# EAGLE board megadonkey_rev0 (EAGLE 4.16), part 1 of 2
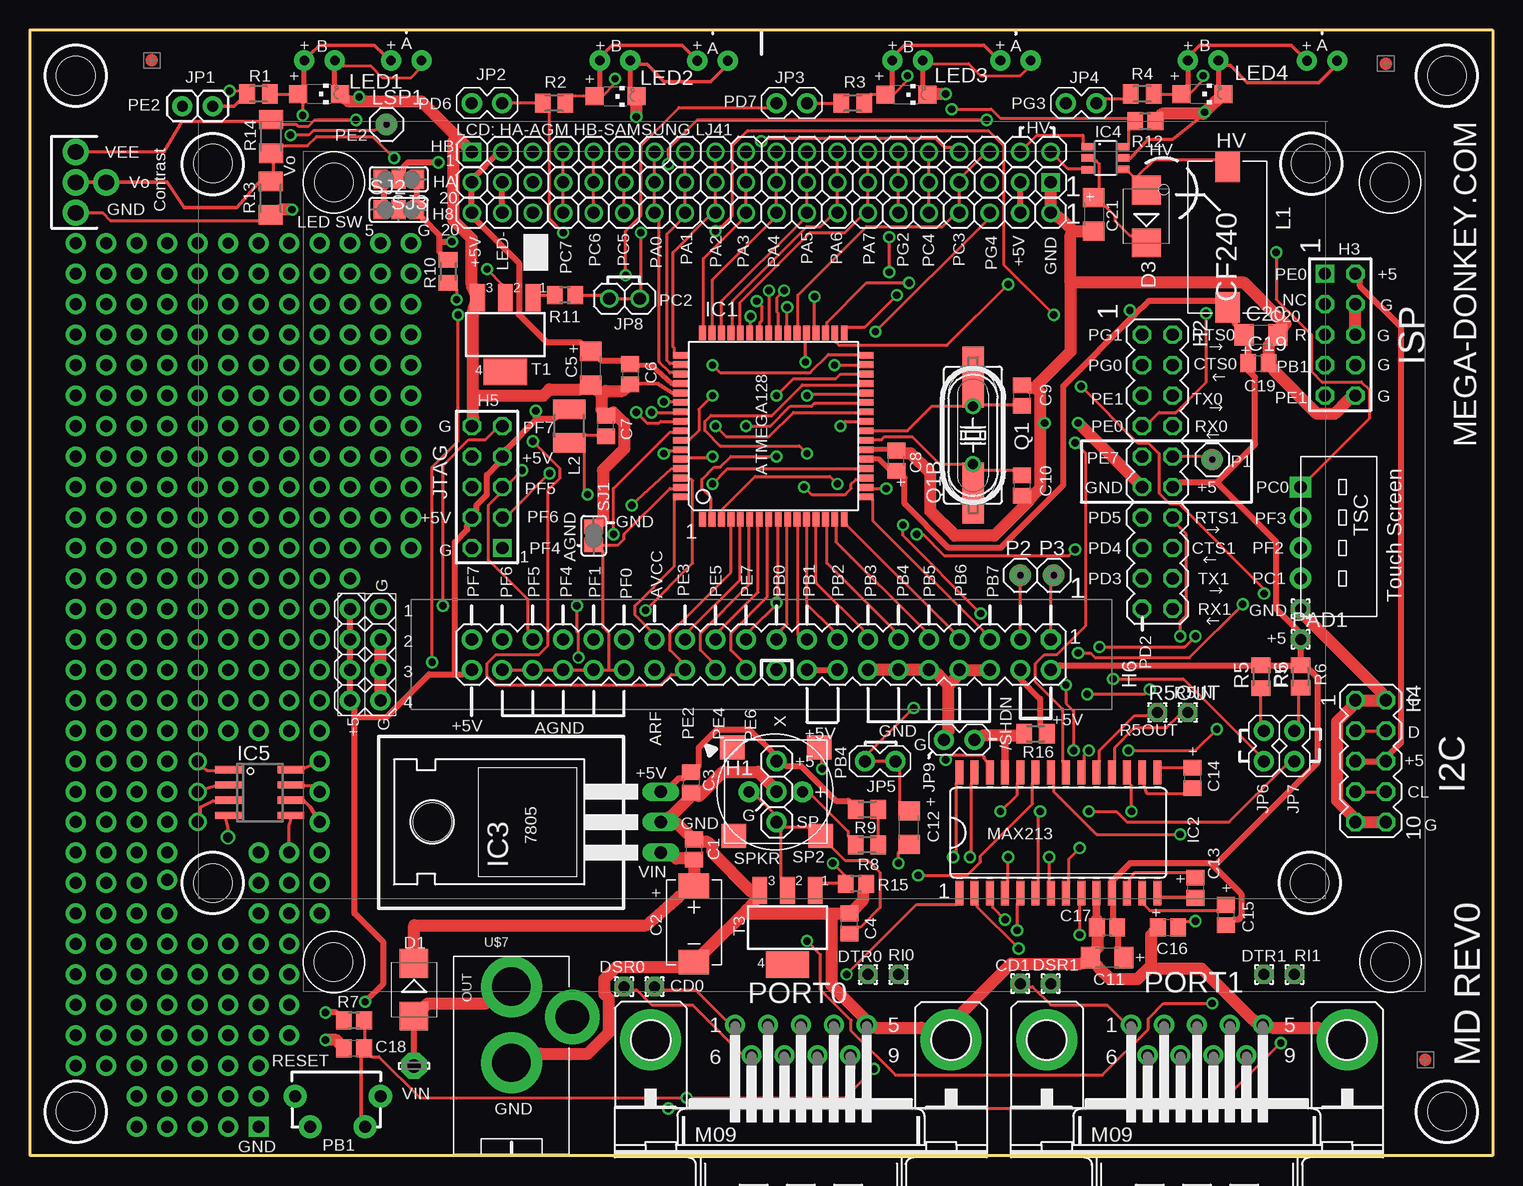
[diagram p2: board, top side]
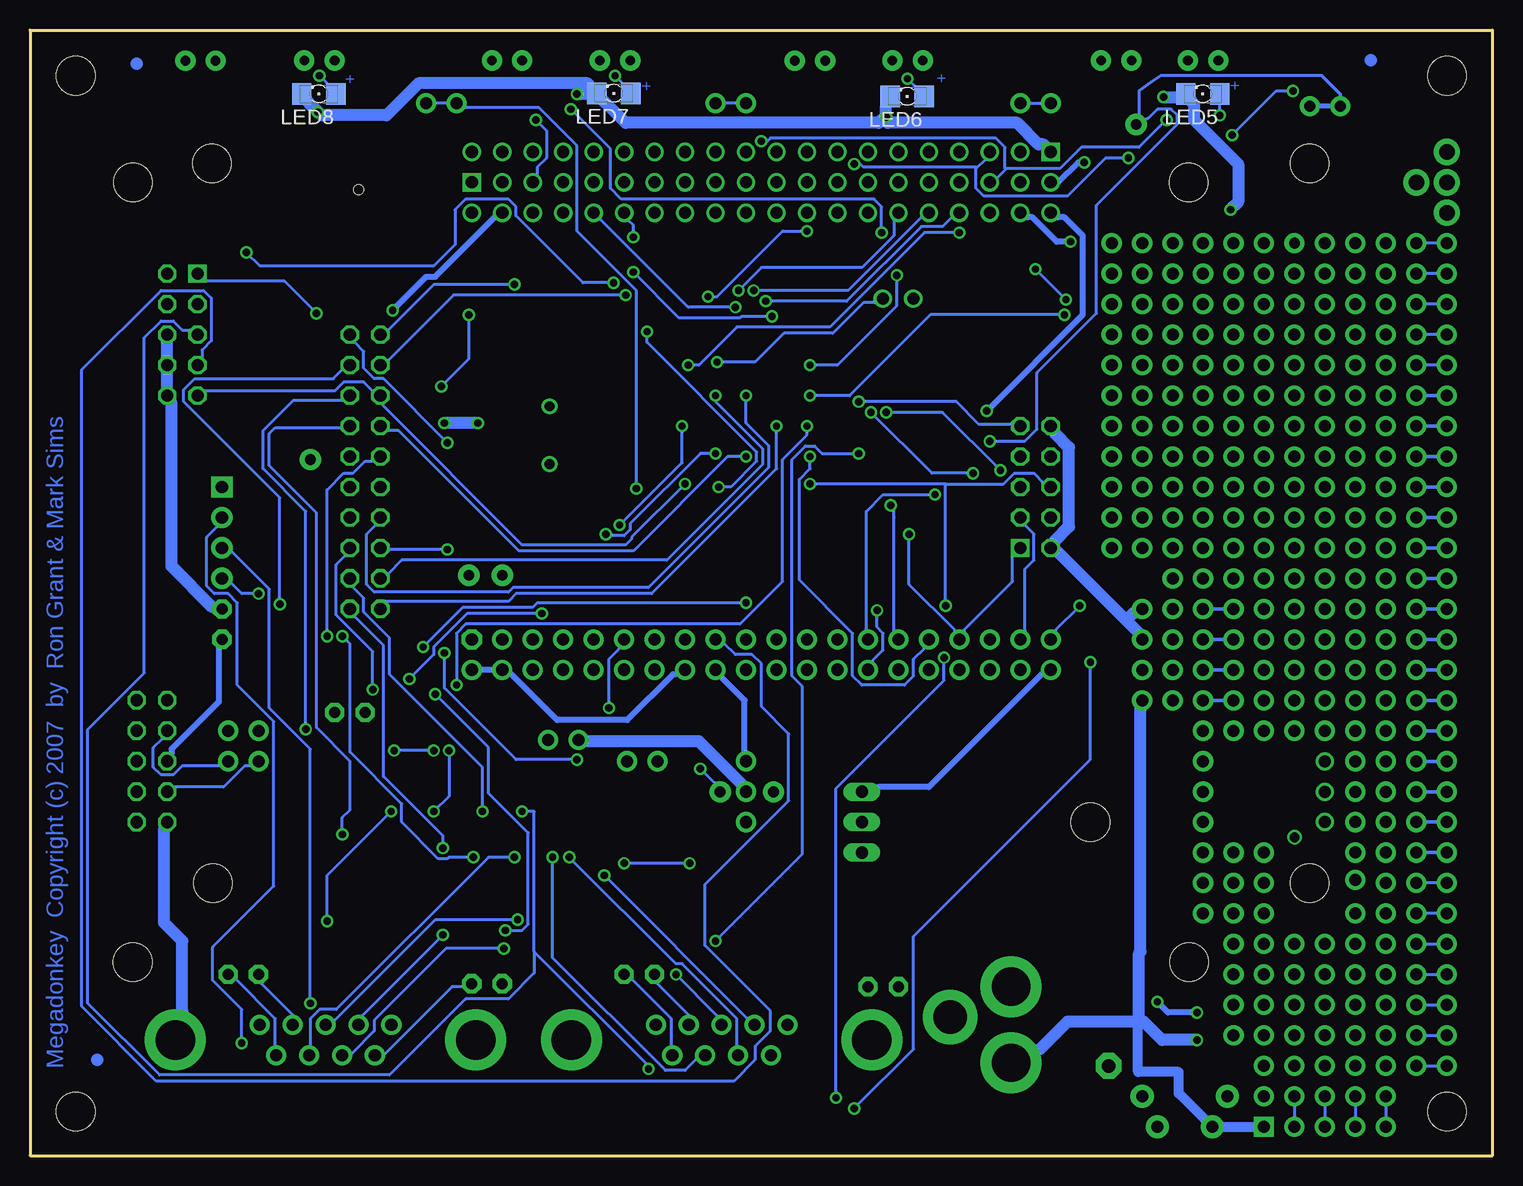
[diagram p3: board, bottom side, seen from below]

Size 121.92 x 93.85 mm. Coordinates in mm from the lower left corner, seen from the top.
Outline: 121.92,0 0,0 0,93.85 121.92,93.85 121.92,0
Copper layers (1*16): Top 0.035mm / dielectric 1.5mm / Bottom 0.035mm
Design rules "default": minimum track width 10mil, minimum drill 24mil, track to track 10mil, track to pad 10mil, pad to pad 10mil, via to via 10mil, smd to smd 8mil, copper to edge 10mil, drill to drill 15mil, minimum pad ring 10mil, minimum via ring 8mil, stop-mask expansion 2.5mil, vias tented up to drill 0mil, thermal gap 10mil
Net classes: 1 VCC: width 0.508 mm; 2 GND: width 1.016 mm
Holes 3.2 mm at 3.81,90.04 3.81,3.68 118.11,3.68 118.11,90.04
Holes 0.8 mm at 94.51,80.54
tRestrict: area -1.8,-21.5 to 124.2,1.7; area 91.8,76.8 to 93.6,79.6; area 87.4,77.6 to 88.6,81.7; area 95,83.7 to 96.3,85; area 89.7,80.9 to 90.4,82.9; area 82.3,85.5 to 89.4,86.2; area 81.9,82.2 to 83.9,82.8; area 81.3,82.7 to 81.8,85; area 86.6,82.4 to 87.6,85; area 83.6,82.7 to 84.1,84.5; area 84.1,84.5 to 86.9,85; area 101.3,77.1 to 102.9,84.2; 33 more areas
bRestrict: area -2.8,-22 to 123.7,1.7; area 82.3,83.4 to 89.7,85.7; area 86.6,76.1 to 102.9,85; area 81.3,82.7 to 81.8,85; area 81.9,82.3 to 83.9,82.8; area 85.6,81.9 to 86.6,83.4; area 109.7,77.7 to 111,85.3; area 75.3,54 to 83.7,65.9; area -0.5,21.2 to 25.1,77.3; area 71.5,58.5 to 75.8,63.6; area 77.1,63.9 to 80.1,67.9; area -1,-1.1 to 17.3,22.5; 15 more areas; 2 lines
vRestrict: area 55.1,66.7 to 69.1,67.9; area 55.1,53.7 to 56.4,67.7; area 54.6,54.2 to 69.1,55.2; area 68.1,53.7 to 69.1,67.7; area 76.6,26.2 to 95.4,27.7; area 76.6,29.2 to 95.6,31; area 57.7,53.7 to 58.9,67.7; area 60.2,53.7 to 61.5,67.7; area 62.7,53.7 to 64,67.7; area 65.3,53.7 to 66.5,67.7; area 55.1,64.1 to 69.1,65.4; area 57.7,53.7 to 58.9,67.7; 25 more areas

## Footprints (pad centres in the part's own frame; a part is rotated, then mirrored left to right if it is on the bottom)
J100-2 = drill 1 pad 1.676 round: 1 -1.27,0; 2 1.27,0
C0805 = smd 1.3 x 1.5: 1 -0.85,0; 2 0.85,0
SMD2917 = smd 2.032 x 2.54: M 3.302,0; P -3.048,0
C1206 = smd 1.6 x 1.8: 1 -1.4,0; 2 1.4,0
1,6/0,9 = drill 0.914 pad 1.6 octagon: 1 0,0
SMB = smd 2.4 x 2.4: A 2.2,0; C -2.2,0
1X03 = drill 1.016 pad 1.676 round: 1 -2.54,0; 2 0,0; 3 2.54,0
MA10-2 = drill 1.016 octagon: 1 -11.43,-1.27; 2 -11.43,1.27; 3 -8.89,-1.27; 4 -8.89,1.27; 5 -6.35,-1.27; 6 -6.35,1.27; 7 -3.81,-1.27; 8 -3.81,1.27; 9 -1.27,-1.27; 10 -1.27,1.27; 11 1.27,-1.27; 12 1.27,1.27; 13 3.81,-1.27; 14 3.81,1.27; 15 6.35,-1.27; 16 6.35,1.27; 17 8.89,-1.27; 18 8.89,1.27; 19 11.43,-1.27; 20 11.43,1.27
AVR-ISP-10 = drill 1.016 square: 1 -5.08,-1.27 | drill 1.016 octagon: 2 -5.08,1.27; 3 -2.54,-1.27; 4 -2.54,1.27; 5 0,-1.27; 6 0,1.27; 7 2.54,-1.27; 8 2.54,1.27; 9 5.08,-1.27; 10 5.08,1.27
MA05-2 = drill 1.016 octagon: 1 -5.08,-1.27; 2 -5.08,1.27; 3 -2.54,-1.27; 4 -2.54,1.27; 5 0,-1.27; 6 0,1.27; 7 2.54,-1.27; 8 2.54,1.27; 9 5.08,-1.27; 10 5.08,1.27
AVR-JTAG-10 = drill 1.016 square: 1 -5.08,-1.27 | drill 1.016 octagon: 2 -5.08,1.27; 3 -2.54,-1.27; 4 -2.54,1.27; 5 0,-1.27; 6 0,1.27; 7 2.54,-1.27; 8 2.54,1.27; 9 5.08,-1.27; 10 5.08,1.27
MA20X2 = drill 1.016 pad 1.676 octagon: 1 -24.13,-1.27 | drill 1.016 pad 1.676 round: 2 -24.13,1.27; 3 -21.59,-1.27; 4 -21.59,1.27; 5 -19.05,-1.27; 6 -19.05,1.27; 7 -16.51,-1.27; 8 -16.51,1.27; 9 -13.97,-1.27; 10 -13.97,1.27; 11 -11.43,-1.27; 12 -11.43,1.27; 13 -8.89,-1.27; 14 -8.89,1.27; 15 -6.35,-1.27; 16 -6.35,1.27; 17 -3.81,-1.27; 18 -3.81,1.27; 19 -1.27,-1.27; 20 -1.27,1.27; 21 1.27,-1.27; 22 1.27,1.27; 23 3.81,-1.27; 24 3.81,1.27; 25 6.35,-1.27; 26 6.35,1.27; 27 8.89,-1.27; 28 8.89,1.27; 29 11.43,-1.27; 30 11.43,1.27; 31 13.97,-1.27; 32 13.97,1.27; 33 16.51,-1.27; 34 16.51,1.27; 35 19.05,-1.27; 36 19.05,1.27; 37 21.59,-1.27; 38 21.59,1.27; 39 24.13,-1.27; 40 24.13,1.27
1X20 = drill 1.016 round: 1 -24.13,0; 2 -21.59,0; 3 -19.05,0; 4 -16.51,0; 5 -13.97,0; 6 -11.43,0; 7 -8.89,0; 8 -6.35,0; 9 -3.81,0; 10 -1.27,0; 11 1.27,0; 12 3.81,0; 13 6.35,0; 14 8.89,0; 15 11.43,0; 16 13.97,0; 17 16.51,0; 18 19.05,0; 19 21.59,0; 20 24.13,0
1X20_AGM1264F = drill 1.016 square: 1 22.86,0 | drill 1.016 round: 2 20.32,0; 3 17.78,0; 4 15.24,0; 5 12.7,0; 6 10.16,0; 7 7.62,0; 8 5.08,0; 9 2.54,0; 10 0,0; 11 -2.54,0; 12 -5.08,0; 13 -7.62,0; 14 -10.16,0; 15 -12.7,0; 16 -15.24,0; 17 -17.78,0; 18 -20.32,0; 19 -22.86,0; 20 -25.4,0 | hole 3.2: -36.906,0; -36.932,-65.024; 51.13,-65.024; 51.105,0
1X20P = drill 1.016 square: 1 -25.4,0 | drill 1.016 round: 2 -22.86,0; 3 -20.32,0; 4 -17.78,0; 5 -15.24,0; 6 -12.7,0; 7 -10.16,0; 8 -7.62,0; 9 -5.08,0; 10 -2.54,0; 11 0,0; 12 2.54,0; 13 5.08,0; 14 7.62,0; 15 10.16,0; 16 12.7,0; 17 15.24,0; 18 17.78,0; 19 20.32,0; 20 22.86,0 | hole 3.2: -46.99,-0.953; 44.514,-0.953; 44.45,-60.96; -46.99,-60.96
TQFP64 = smd 1.194 x 0.559: 1 -7.76,5.905; 2 -7.76,5.118; 3 -7.76,4.331; 4 -7.76,3.543; 5 -7.76,2.756; 6 -7.76,1.968; 7 -7.76,1.181; 8 -7.76,0.394; 9 -7.76,-0.394; 10 -7.76,-1.181; 11 -7.76,-1.968; 12 -7.76,-2.756; 13 -7.76,-3.543; 14 -7.76,-4.331; 15 -7.76,-5.118; 16 -7.76,-5.905; 33 7.76,-5.905; 34 7.76,-5.118; 35 7.76,-4.331; 36 7.76,-3.543; 37 7.76,-2.756; 38 7.76,-1.968; 39 7.76,-1.181; 40 7.76,-0.394; 41 7.76,0.394; 42 7.76,1.181; 43 7.76,1.968; 44 7.76,2.756; 45 7.76,3.543; 46 7.76,4.331; 47 7.76,5.118; 48 7.76,5.905 | smd 0.559 x 1.194: 17 -5.905,-7.76; 18 -5.118,-7.76; 19 -4.331,-7.76; 20 -3.543,-7.76; 21 -2.756,-7.76; 22 -1.968,-7.76; 23 -1.181,-7.76; 24 -0.394,-7.76; 25 0.394,-7.76; 26 1.181,-7.76; 27 1.968,-7.76; 28 2.756,-7.76; 29 3.543,-7.76; 30 4.331,-7.76; 31 5.118,-7.76; 32 5.905,-7.76; 49 5.905,7.76; 50 5.118,7.76; 51 4.331,7.76; 52 3.543,7.76; 53 2.756,7.76; 54 1.968,7.76; 55 1.181,7.76; 56 0.394,7.76; 57 -0.394,7.76; 58 -1.181,7.76; 59 -1.968,7.76; 60 -2.756,7.76; 61 -3.543,7.76; 62 -4.331,7.76; 63 -5.118,7.76; 64 -5.905,7.76
SO28L = smd 0.66 x 2.032: 1 -8.255,-5.029; 2 -6.985,-5.029; 3 -5.715,-5.029; 4 -4.445,-5.029; 5 -3.175,-5.029; 6 -1.905,-5.029; 7 -0.635,-5.029; 8 0.635,-5.029; 9 1.905,-5.029; 10 3.175,-5.029; 11 4.445,-5.029; 12 5.715,-5.029; 13 6.985,-5.029; 14 8.255,-5.029; 15 8.255,5.029; 16 6.985,5.029; 17 5.715,5.029; 18 4.445,5.029; 19 3.175,5.029; 20 1.905,5.029; 21 0.635,5.029; 22 -0.635,5.029; 23 -1.905,5.029; 24 -3.175,5.029; 25 -4.445,5.029; 26 -5.715,5.029; 27 -6.985,5.029; 28 -8.255,5.029
7805H = drill 1.016 long: 1 -2.54,-6.35; 2 0,-6.35; 3 2.54,-6.35 | hole 3.2: 0,12.7
TOKO6_3MM = smd 0.6 x 1: 1 -0.95,-1.5; 2 0,-1.5; 3 1,-1.5; 4 0.95,1.5; 5 0,1.5; 6 -0.95,1.5
SO-8 = smd 0.6 x 2.2: 1 -1.905,-2.6; 2 -0.635,-2.6; 3 0.635,-2.6; 4 1.905,-2.6; 5 1.905,2.6; 6 0.635,2.6; 7 -0.635,2.6; 8 -1.905,2.6
1X02 = drill 1.016 round: 1 -1.27,0; 2 1.27,0
SMD550X240 = smd 2.54 x 2.032: 1 -5.842,0; 2 5.842,0
R1210 = smd 1.6 x 2.7: 1 -1.4,0; 2 1.4,0
CHIPLED_1206 = smd 1.5 x 1.5: A 0,-1.75; C 0,1.75
1206 = smd 1.6 x 1.803: A -1.422,0; C 1.422,0
MCS08 = drill 0.9 pad 1.778 round: MP 0,0
M09H0500 = drill 1.016 pad 1.676 round: 1 -5.486,8.255; 2 -2.743,8.255; 3 0,8.255; 4 2.743,8.255; 5 5.486,8.255; 6 -4.115,5.715; 7 -1.372,5.715; 8 1.372,5.715; 9 4.115,5.715 | drill 3.302 pad 5.08 round: G1 -12.522,6.985; G2 12.522,6.985
HC49U70 = drill 0.813 round: 1 -2.413,0; 2 2.413,0
SM49 = smd 5.08 x 1.778: 1 -4.826,0; 2 4.826,0
M0805 = smd 1.3 x 1.6: 1 -0.95,0; 2 0.95,0
R0805 = smd 1.3 x 1.5: 1 -0.85,0; 2 0.85,0
M1206 = smd 1.6 x 2: 1 -1.4,0; 2 1.4,0
SJ = smd 1.168 x 1.6: 1 -0.762,0; 2 0.762,0
SJ_2 = smd 1.168 x 1.6: 1 -1.524,0; 2 0,0; 3 1.524,0
BG_SPKR = drill 0.9 pad 1.778 round: 1 -2.286,0; 2 2.159,0
CHB-04H = smd 2.032 x 2.032: 1 -3.683,3.683; 2 -3.556,-3.683; 3 3.556,3.683; 4 3.683,-3.683
SOT223 = smd 1.219 x 2.235: 1 -2.311,-3.099; 2 0,-3.099; 3 2.311,-3.099 | smd 3.6 x 2.2: 4 0,3.099
FFC4-VERT = drill 1.016 pad 1.778 square: 1 -3.81,0 | drill 1.016 pad 1.778 round: 2 -1.27,0; 3 1.27,0; 4 3.81,0
POWER_21 = drill 2.8 pad 4.572 round: BAT 5.08,3.81 | drill 3.2 pad 5.08 round: COM 0,0; OUT 0,6.35
LSP11 = drill 1.118 pad 2.159 octagon: MP 0,0

## Placement (x,y rotation side)
1  [J100-2]  27.94,45.59 0 top
2  [J100-2]  27.94,43.05 0 top
3  [J100-2]  27.94,40.51 0 top
4  [J100-2]  27.94,37.97 0 top
C1  0.1 uF  [C0805]  55.37,25.53 90 top
C2  15 uF TANT  [SMD2917]  55.35,19.46 270 top
C3  0.1 uF  [C0805]  55.12,31.12 270 top
C4  0.47 uF  [C0805]  68.33,19.35 90 top
C5  10 uF  [C1206]  46.74,65.66 270 top
C6  .1 uF  [C0805]  50.04,65.15 270 top
C7  .1 uF  [C0805]  48.01,60.83 90 top
C8  .1 uF  [C0805]  72.21,57.94 90 top
C9  18 pF  [C0805]  82.68,63.37 90 top
C10  18 pF  [C0805]  82.68,55.88 270 top
C11  10 uF  [C1206]  89.79,16.51 180 top
C12  10 uF  [C1206]  73.28,27.36 90 top
C13  0.47uF  [C0805]  97.16,22.35 270 top
C14  0.47uF  [C0805]  96.9,31.5 270 top
C15  0.47uF  [C0805]  99.7,20.07 270 top
C16  0.47uF  [C0805]  94.87,19.05 0 top
C17  .1 uF  [C0805]  89.79,19.05 180 top
C18  [C0805]  27,8.94 180 top
C19  0.1 uF  [C0805]  102.39,66.07 0 top
C20  10 uF  [C1206]  102.62,68.45 0 top
C21  .1 uF 100V  [C1206]  88.67,78.49 270 top
CD0  [1,6/0,9]  52.07,14.1 0 top
CD1  [1,6/0,9]  82.55,14.35 0 top
D1  MBRS140  [SMB]  32,13.84 270 top
D3  MURS130  [SMB]  93.07,78.31 90 top
DSR0  [1,6/0,9]  49.53,14.1 0 top
DSR1  [1,6/0,9]  85.09,14.35 0 top
DTR0  [1,6/0,9]  69.85,15.11 0 top
DTR1  [1,6/0,9]  102.87,15.11 0 top
GND  G  [1,6/0,9]  105.92,45.59 0 top
H1  HEADER1X3  [1X03]  62.23,30.35 90 top
H2  [MA10-2]  93.98,57.02 270 top
H3  AVR-ISP-10  [AVR-ISP-10]  109.22,68.45 270 top
H4  [MA05-2]  111.76,32.89 270 top
H5  AVR-JTAG-10  [AVR-JTAG-10]  38.1,55.75 90 top
H6  MA20-2_SHROUD  [MA20X2]  60.96,41.78 180 top
H8  [1X20]  60.96,78.61 180 top
HA  LCD_AGM1264F  [1X20_AGM1264F]  62.23,81.15 0 top
HB  EL_LCD  [1X20P]  62.23,83.69 0 top
IC1  ATMEGA128-2  [TQFP64]  61.98,60.83 90 top
IC2  MAX213ECWI  [SO28L]  85.73,26.92 0 top
IC3  7805  [7805H]  46.23,27.81 90 top
IC4  TK6593  [TOKO6_3MM]  89.66,83.18 270 top
IC5  [SO-8]  19.15,30.28 270 top
JP2  [J100-2]  38.1,87.76 0 top
JP3  [J100-2]  63.5,87.76 0 top
JP4  [J100-2]  87.63,87.76 0 top
JP5  [J100-2]  70.87,32.89 0 top
JP6  [J100-2]  102.87,34.16 270 top
JP7  [J100-2]  105.41,34.16 270 top
JP8  [1X02]  49.56,71.45 0 top
JP9  [J100-2]  77.47,34.67 180 top
L1  470 uH  [SMD550X240]  99.82,76.58 90 top
L2  10 uH  [R1210]  44.96,60.83 90 top
LED1  [CHIPLED_1206]  24.1,88.52 270 top
LED2  [CHIPLED_1206]  48.79,88.32 270 top
LED3  [CHIPLED_1206]  73.05,88.47 270 top
LED4  [CHIPLED_1206]  97.74,88.52 270 top
LED5  [1206]  24.16,88.52 180 bottom
LED6  [1206]  48.79,88.32 180 bottom
LED7  [1206]  73.25,88.57 180 bottom
LED8  [1206]  97.84,88.52 180 bottom
LSP1  MCS08  [MCS08]  29.72,85.98 0 top
P1  MCS08  [MCS08]  98.55,58.04 0 top
P2  MCS08  [MCS08]  82.55,48.39 0 top
P3  MCS08  [MCS08]  85.34,48.39 0 top
PAD1  [1,6/0,9]  105.92,43.05 0 top
PORT0  SUBD9M500  [M09H0500]  64.26,2.67 0 top
PORT1  SUBD9M500  [M09H0500]  97.28,2.67 0 top
Q1  16 MHz  [HC49U70]  78.61,60.07 90 top
Q1B  NC  [SM49]  78.61,60.07 90 top
R1  10.2K  [M0805]  19.05,88.52 0 top
R2  10.2K  [M0805]  43.69,87.76 0 top
R3  10.2K  [M0805]  68.58,87.76 0 top
R4  10.2K  [M0805]  92.71,88.52 0 top
R5  1.58K  [M0805]  102.62,39.93 90 top
R5IN  [1,6/0,9]  96.52,36.96 0 top
R5OUT  [1,6/0,9]  93.98,36.96 0 top
R6  1.58K  [M0805]  105.92,39.95 90 top
R7  10.2K  [R0805]  27,11.28 180 top
R8  15  [M0805]  69.77,25.91 0 top
R9  15  [M0805]  69.77,28.88 180 top
R10  15  [M0805]  34.85,73.74 90 top
R11  1K  [R0805]  44.6,71.75 180 top
R12  2.37K  [R0805]  92.96,86.23 180 top
R13  NC  [M1206]  20.07,79.83 270 top
R14  374  [M1206]  20.09,84.96 270 top
R15  2.37K  [R0805]  68.86,22.66 180 top
R16  10.2K  [M0805]  83.82,35.18 180 top
RI0  [1,6/0,9]  72.39,15.11 0 top
RI1  [1,6/0,9]  105.41,15.11 0 top
SJ1  [SJ]  46.99,51.69 270 top
SJ2  [SJ_2]  30.73,78.87 0 top
SJ3  [SJ_2]  30.73,81.41 180 top
SP1  BG_SPKR  [BG_SPKR]  62.1,30.33 180 top
SP2  NC  [CHB-04H]  62.23,30.35 0 top
T1  CKT3015  [SOT223]  39.62,68.45 180 top
T3  CKT3015  [SOT223]  63.14,19.02 180 top
TARGET_LL  [1MM_ALIGNMENT_TARGET]  10.16,91.31 0 top
TARGET_LR  [1MM_ALIGNMENT_TARGET]  116.33,8 0 top
TARGET_UR  [1MM_ALIGNMENT_TARGET]  113.03,91.06 0 top
TSC  FFC4VERT  [FFC4-VERT]  105.92,51.94 270 top
U$7  POWER_JACK_21  [POWER_21]  40.13,7.75 0 top
VIN  LSP11  [LSP11]  32,7.49 0 top